# EAGLE design l293_board (EAGLE 7.1.0)
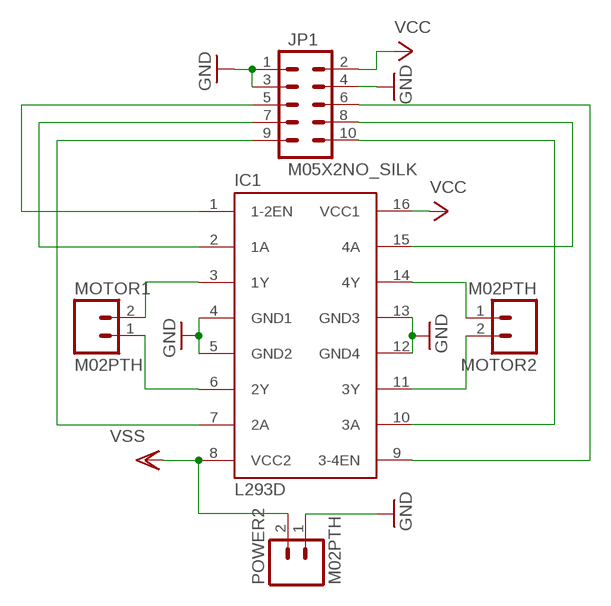
[diagram p0: schematic, sheet 1]

## Parts
IC1  L293D  [DIL16]
JP1  M05X2NO_SILK  [2X5_NOSILK]
MOTOR1  M02PTH  [1X02]
MOTOR2  M02PTH  [1X02]
POWER2  M02PTH  [1X02]

## Nets
GND: IC1.4(GND1) IC1.5(GND2) IC1.12(GND4) IC1.13(GND3) JP1.1 JP1.3 JP1.4 POWER2.1
N$1: IC1.9(3-4EN) JP1.6
N$2: IC1.1(1-2EN) JP1.5
N$3: IC1.3(1Y) MOTOR1.2
N$4: IC1.6(2Y) MOTOR1.1
N$5: IC1.15(4A) JP1.8
N$6: IC1.2(1A) JP1.7
N$7: IC1.7(2A) JP1.9
N$9: IC1.14(4Y) MOTOR2.1
N$10: IC1.11(3Y) MOTOR2.2
N$11: IC1.10(3A) JP1.10
VCC: IC1.16(VCC1) JP1.2
VSS: IC1.8(VCC2) POWER2.2

## Library data of the parts
IC1 = st-microelectronics:L293D: PUSH-PULL 4 CHANNEL DRIVER; MPN: L293D; OC_FARNELL: 9589619; OC_NEWARK: 56P8249
JP1 = SparkFun-Connectors:M05X2: Header 5x2 Standard 10-pin dual row 0.1" header. Commonly used with AVR-ISP. Use with Spark Fun Electronics SKU: PRT-00778
MOTOR1 MOTOR2 POWER2 = SparkFun-Connectors:M02: Standard 2-pin 0.1" header. Use with - straight break away headers ( PRT-00116) - right angle break away headers (PRT-00553) - swiss pins (PRT-00743) - machine pins (PRT-00117) - female headers (PRT-00115) Molex polarized connector foot print use with: PRT-08233 with associated crimp pins and housings. 2.54_SCREWTERM for use with PRT-10571. 3.5mm Screw Terminal footprints for PRT-08084 5mm Screw Terminal footprints for use with PRT-08432

## Net classes
0 default: clearance 0.205 mm

## Board
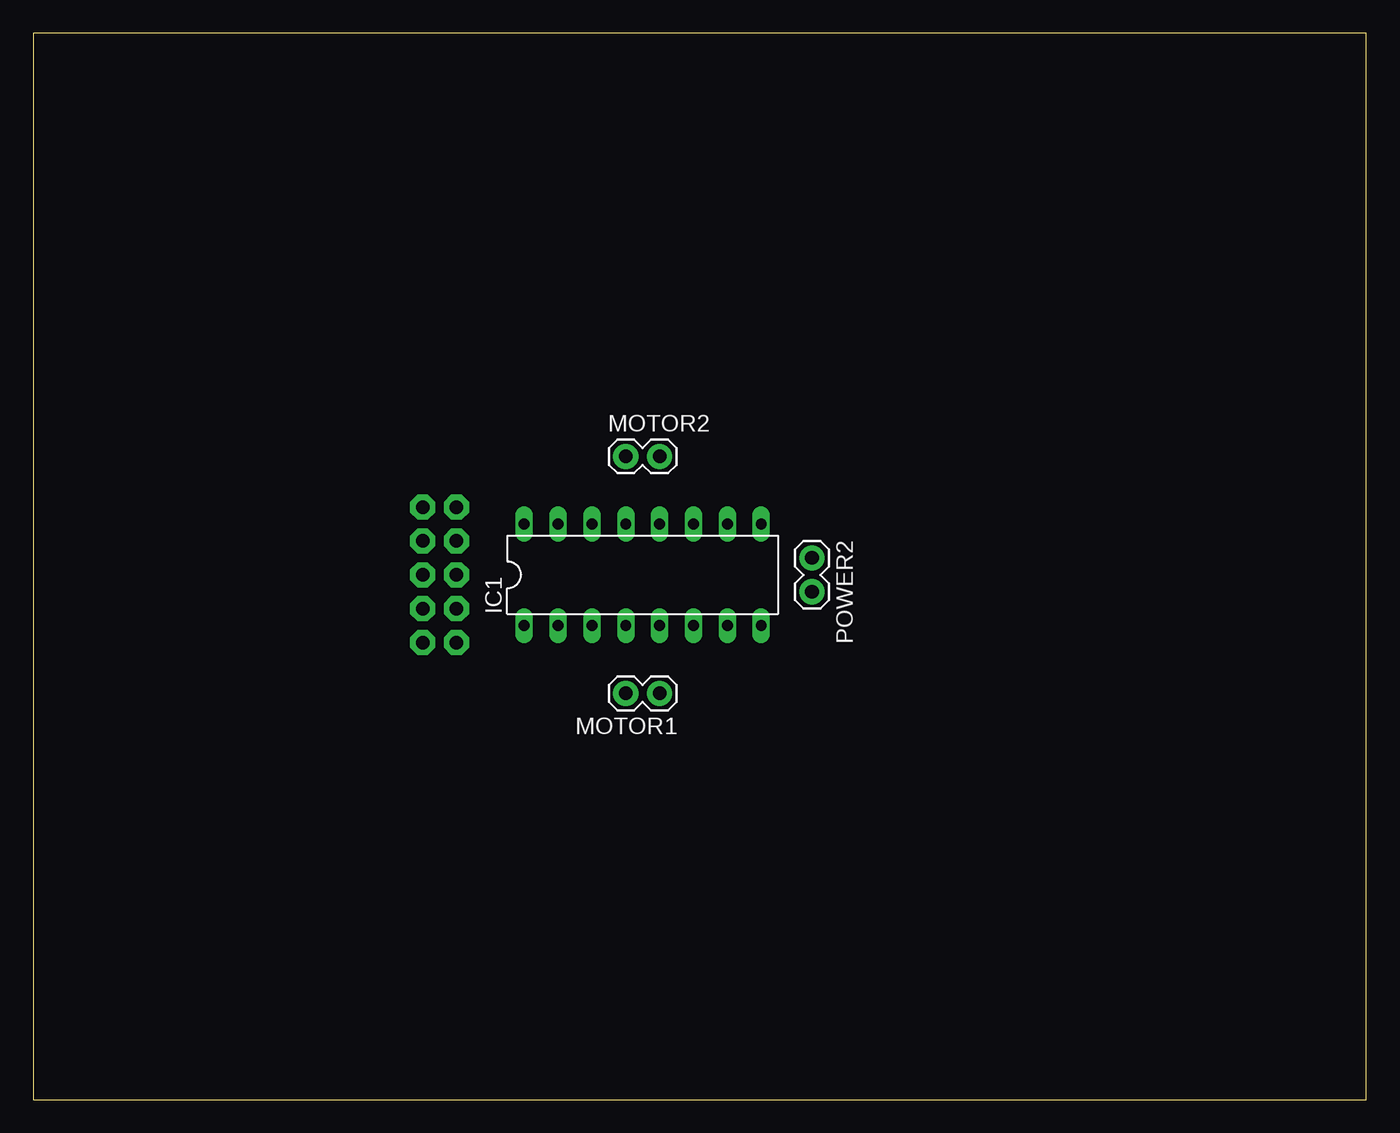
[diagram p1: board, top side]
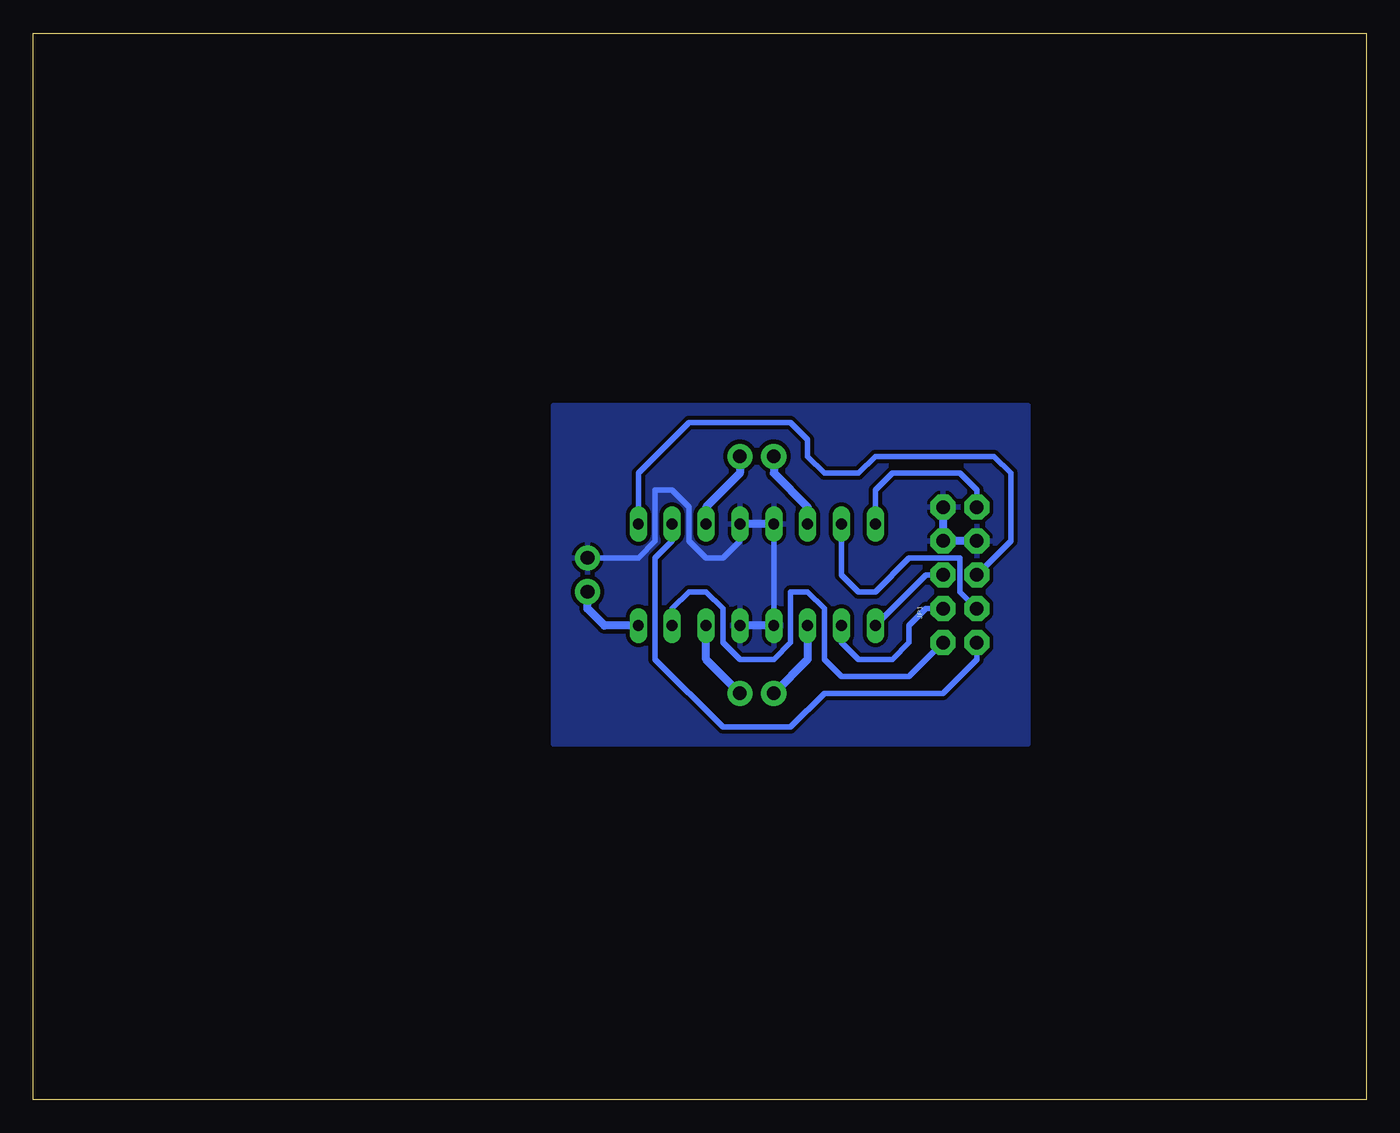
[diagram p2: board, bottom side, seen from below]

Size 100 x 80 mm. Coordinates in mm from the lower left corner, seen from the top.
Outline: 0,0 100,0 100,80 0,80 0,0
Copper layers (1*16): Top 0.035mm / dielectric 1.5mm / Bottom 0.035mm
Design rules "default": minimum track width 10mil, minimum drill 24mil, track to track 8mil, track to pad 8mil, pad to pad 8mil, via to via 8mil, smd to smd 8mil, copper to edge 40mil, drill to drill 8mil, minimum pad ring 10mil, minimum via ring 8mil, stop-mask expansion 4mil, vias tented up to drill 0mil, thermal gap 10mil

### Footprints (pad centres in the part's own frame; a part is rotated, then mirrored left to right if it is on the bottom)
DIL16 = drill 0.813 long: 1 -8.89,-3.81; 2 -6.35,-3.81; 3 -3.81,-3.81; 4 -1.27,-3.81; 5 1.27,-3.81; 6 3.81,-3.81; 7 6.35,-3.81; 8 8.89,-3.81; 9 8.89,3.81; 10 6.35,3.81; 11 3.81,3.81; 12 1.27,3.81; 13 -1.27,3.81; 14 -3.81,3.81; 15 -6.35,3.81; 16 -8.89,3.81
2X5_NOSILK = drill 1.016 pad 1.88 octagon: 1 -1.27,5.08; 2 1.27,5.08; 3 -1.27,2.54; 4 1.27,2.54; 5 -1.27,0; 6 1.27,0; 7 -1.27,-2.54; 8 1.27,-2.54; 9 -1.27,-5.08; 10 1.27,-5.08
1X02 = drill 1.016 pad 1.88: 1 0,0; 2 2.54,0

### Placement (x,y rotation side)
IC1  45.72,39.37 0 top
JP1  30.48,39.37 0 bottom
MOTOR1  46.99,30.48 180 top
MOTOR2  44.45,48.26 0 top
POWER2  58.42,40.64 270 top

### Tracks (layer width: path | path; a pad name or v marks a point on that pad's centre or on a via)
GND
  Bottom 0.406: IC1.12 46.99,41.91 48.26,40.64 49.53,40.64 50.8,41.91 50.8,44.45 52.07,45.72 53.34,45.72 53.34,41.91 54.61,40.64 POWER2.1 | IC1.13 IC1.4
  Bottom 0.61: IC1.13 IC1.12 | IC1.4 IC1.5 | JP1.1 JP1.3 JP1.4
  pour Bottom (isolate 0.305): 25.4,52.07 60.96,52.07 60.96,26.67 25.4,26.67
N$1
  Bottom 0.406: IC1.9 54.61,46.99 50.8,50.8 43.18,50.8 41.91,49.53 41.91,48.26 40.64,46.99 38.1,46.99 36.83,48.26 27.94,48.26 26.67,46.99 26.67,41.91 JP1.6
N$2
  Bottom 0.406: JP1.5 33.02,39.37 IC1.1
N$3
  Bottom 0.61: IC1.3 41.91,33.02 MOTOR1.2
N$4
  Bottom 0.61: MOTOR1.1 49.53,33.02 IC1.6
N$5
  Bottom 0.406: JP1.8 30.48,38.1 30.48,40.64 34.29,40.64 36.83,38.1 38.1,38.1 39.37,39.37 IC1.15
N$6
  Bottom 0.406: JP1.7 33.02,36.83 34.29,35.56 34.29,34.29 35.56,33.02 38.1,33.02 39.37,34.29 IC1.2
N$7
  Bottom 0.406: JP1.9 34.29,31.75 39.37,31.75 40.64,33.02 40.64,36.83 41.91,38.1 43.18,38.1 43.18,34.29 44.45,33.02 46.99,33.02 48.26,34.29 48.26,36.83 49.53,38.1 50.8,38.1 52.07,36.83 IC1.7
N$9
  Bottom 0.61: MOTOR2.1 44.45,46.99 41.91,44.45 IC1.14
N$10
  Bottom 0.61: MOTOR2.2 46.99,46.99 49.53,44.45 IC1.11
N$11
  Bottom 0.406: JP1.10 29.21,33.02 31.75,30.48 40.64,30.48 43.18,27.94 48.26,27.94 53.34,33.02 53.34,40.64 52.07,41.91 IC1.10
VCC
  Bottom 0.406: JP1.2 29.21,45.72 30.48,46.99 35.56,46.99 36.83,45.72 IC1.16
VSS
  Bottom 0.61: IC1.8 57.15,35.56 58.42,36.83 POWER2.2